# EAGLE design 5082_7415_mk1_v1 (EAGLE 6.5.0)
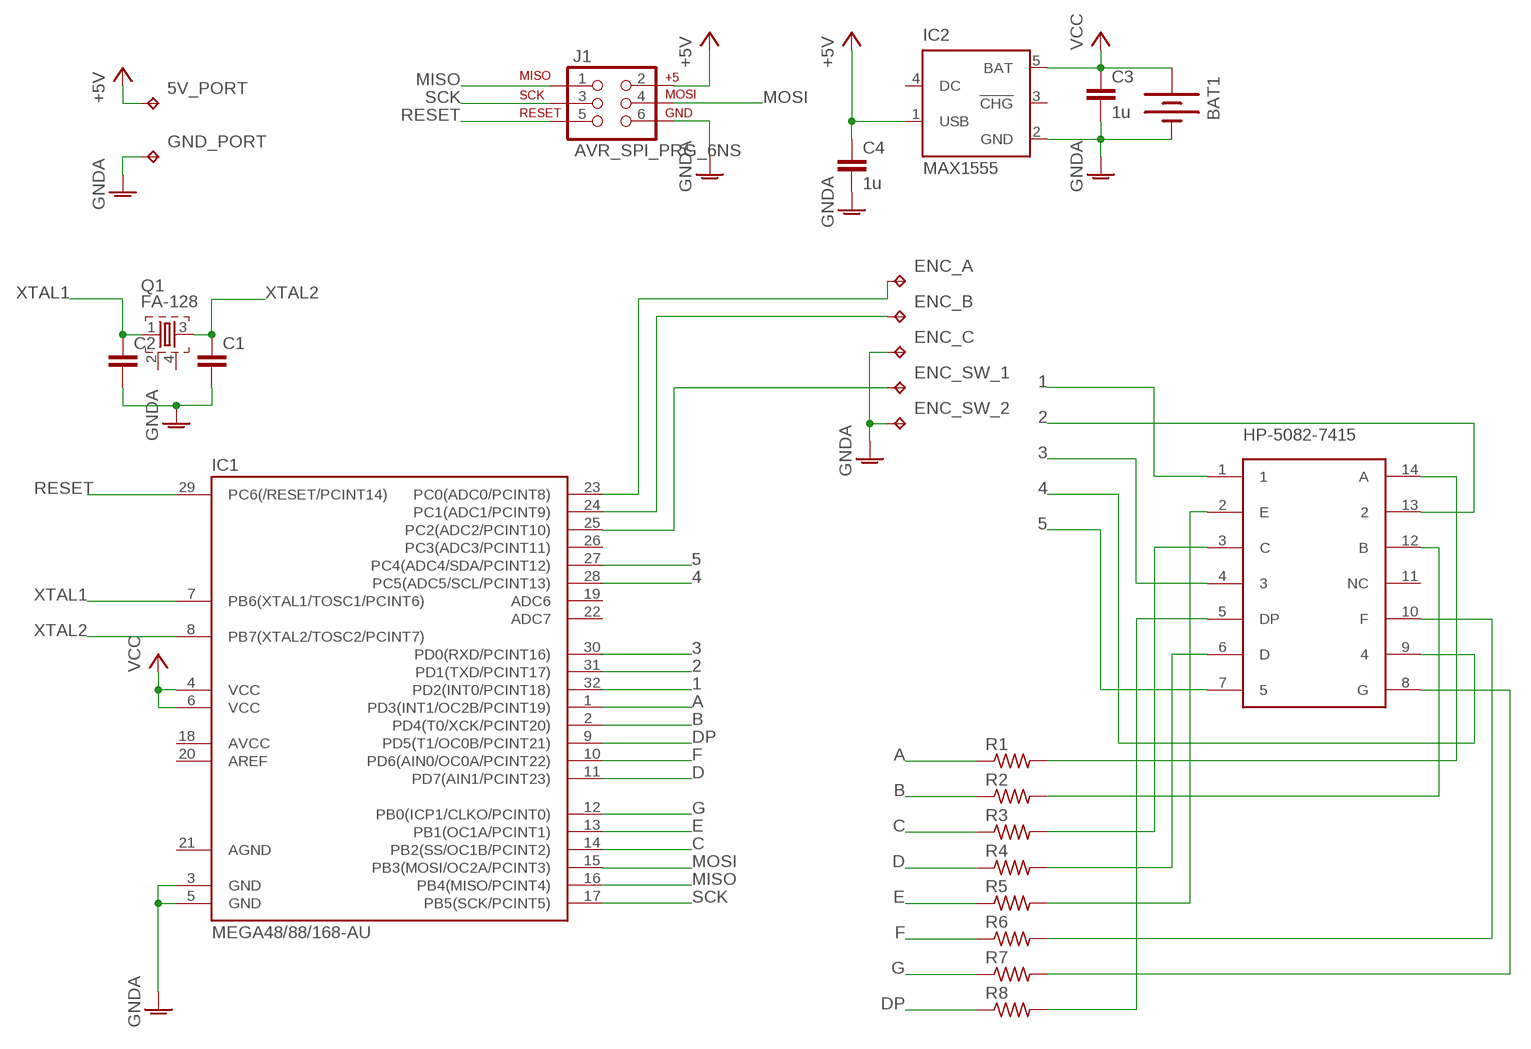
[diagram p0: schematic, sheet 1]

## Parts
5V_PORT  TPB2,54  [B2,54]
BAT1  BATTERY245MM  [BATTCON_245MM]
C1  C-EUC0805  [C0805]
C2  C-EUC0805  [C0805]
C3  1u  C-EUC0805  [C0805]
C4  1u  C-EUC0805  [C0805]
ENC_A  TPTP20SQ  [TP20SQ]
ENC_B  TPTP20SQ  [TP20SQ]
ENC_C  TPTP20SQ  [TP20SQ]
ENC_SW_1  TPTP20SQ  [TP20SQ]
ENC_SW_2  TPTP20SQ  [TP20SQ]
GND_PORT  TPB2,54  [B2,54]
IC1  MEGA48/88/168-AU  [TQFP32-08]
IC2  MAX1555  [SOT23-5L]
J1  AVR_SPI_PRG_6NS  [2X3-NS]
Q1  FA-128  [FA-128]
R1  R-US_M0805  [M0805]
R2  R-US_M0805  [M0805]
R3  R-US_M0805  [M0805]
R4  R-US_M0805  [M0805]
R5  R-US_M0805  [M0805]
R6  R-US_M0805  [M0805]
R7  R-US_M0805  [M0805]
R8  R-US_M0805  [M0805]
U$1  HP-5082-7415  [DIL14]

## Nets
1: IC1.32(PD2(INT0/PCINT18)) U$1.1
2: IC1.31(PD1(TXD/PCINT17)) U$1.13
3: IC1.30(PD0(RXD/PCINT16)) U$1.4
4: IC1.28(PC5(ADC5/SCL/PCINT13)) U$1.9
5: IC1.27(PC4(ADC4/SDA/PCINT12)) U$1.7
+5V: 5V_PORT.TP C4.1 IC2.1(USB) J1.2
A: IC1.1(PD3(INT1/OC2B/PCINT19)) R1.1
B: IC1.2(PD4(T0/XCK/PCINT20)) R2.1
C: IC1.14(PB2(SS/OC1B/PCINT2)) R3.1
D: IC1.11(PD7(AIN1/PCINT23)) R4.1
DP: IC1.9(PD5(T1/OC0B/PCINT21)) R8.1
E: IC1.13(PB1(OC1A/PCINT1)) R5.1
F: IC1.10(PD6(AIN0/OC0A/PCINT22)) R6.1
G: IC1.12(PB0(ICP1/CLKO/PCINT0)) R7.1
GNDA: BAT1.2(-) C1.2 C2.2 C3.2 C4.2 ENC_C.TP ENC_SW_2.TP GND_PORT.TP IC1.3(GND) IC1.5(GND) IC2.2(GND) J1.6
MISO: IC1.16(PB4(MISO/PCINT4)) J1.1
MOSI: IC1.15(PB3(MOSI/OC2A/PCINT3)) J1.4
N$1: R1.2 U$1.14(A)
N$2: R2.2 U$1.12(B)
N$3: R3.2 U$1.3(C)
N$4: R4.2 U$1.6(D)
N$5: R5.2 U$1.2(E)
N$6: R6.2 U$1.10(F)
N$7: R7.2 U$1.8(G)
N$8: R8.2 U$1.5(DP)
N$9: ENC_A.TP IC1.23(PC0(ADC0/PCINT8))
N$10: ENC_B.TP IC1.24(PC1(ADC1/PCINT9))
N$11: ENC_SW_1.TP IC1.25(PC2(ADC2/PCINT10))
RESET: IC1.29(PC6(/RESET/PCINT14)) J1.5
SCK: IC1.17(PB5(SCK/PCINT5)) J1.3
VCC: BAT1.1(+) C3.1 IC1.4(VCC) IC1.6(VCC) IC2.5(BAT)
XTAL1: C2.1 IC1.7(PB6(XTAL1/TOSC1/PCINT6)) Q1.1
XTAL2: C1.1 IC1.8(PB7(XTAL2/TOSC2/PCINT7)) Q1.3
Unconnected: IC1.18(AVCC) IC1.19(ADC6) IC1.20(AREF) IC1.22(ADC7) IC1.26(PC3(ADC3/PCINT11)) IC2.3(!CHG) IC2.4(DC) Q1.2 Q1.4 U$1.11(NC)

## Power pins joined to a net without a drawn wire
AGND: IC1.21(AGND)

## Library data of the parts
5V_PORT ENC_A ENC_B ENC_C ENC_SW_1 ENC_SW_2 GND_PORT = testpad:TP: Test pad
BAT1 = SparkFun-Electromechanical:BATTERY: Battery Holders Various common sizes : AA, AAA, 20mm coin cell and 12mm coin cell. 20MM_4LEGS, BATT-10373
C1-C4 = rcl:C-EU: CAPACITOR, European symbol
IC1 = avr-7:MEGA48/88/168
IC2 = maxim:MAX1555: Dual-Input USB/AC Adapter 1-Cell Li+ Battery Chargers Source: http://www.maxim-ic.com .. MAX1551-MAX1555.pdf; MF: MAXIM; MPN: MAX1555EZK+T; OC_FARNELL: 1628222; OC_NEWARK: 59J2761
J1 = SparkFun-Connectors:AVR_SPI_PRG_6: AVR ISP 6 Pin This is the reduced ISP connector for AVR programming. Common on Arduino. This footprint will take up less PCB space and can be used with a 10-pin to 6-pin adapter such as SKU: BOB-08508
Q1 = crystal:FA-: MHz RANGE CRYSTAL UNIT Source: Epson Toyocom
R1-R8 = rcl:R-US_: RESISTOR, American symbol
U$1 = custom_parts:HP-5082-7415

## Board
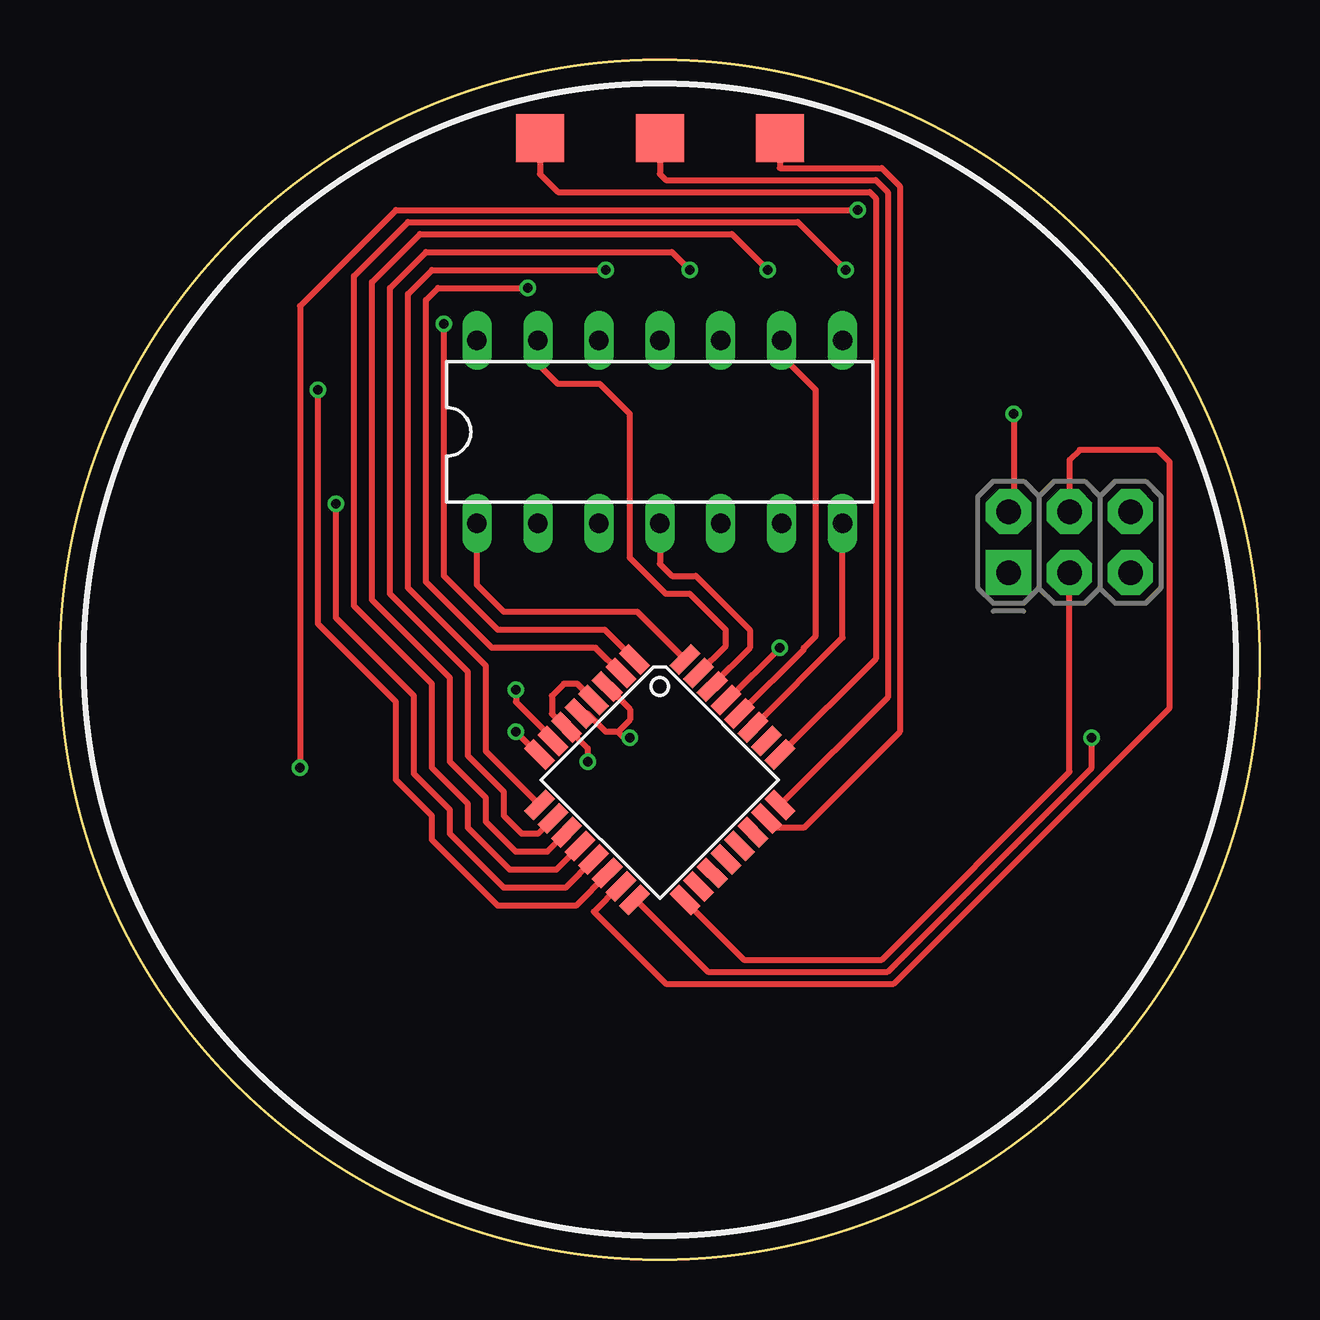
[diagram p1: board, top side]
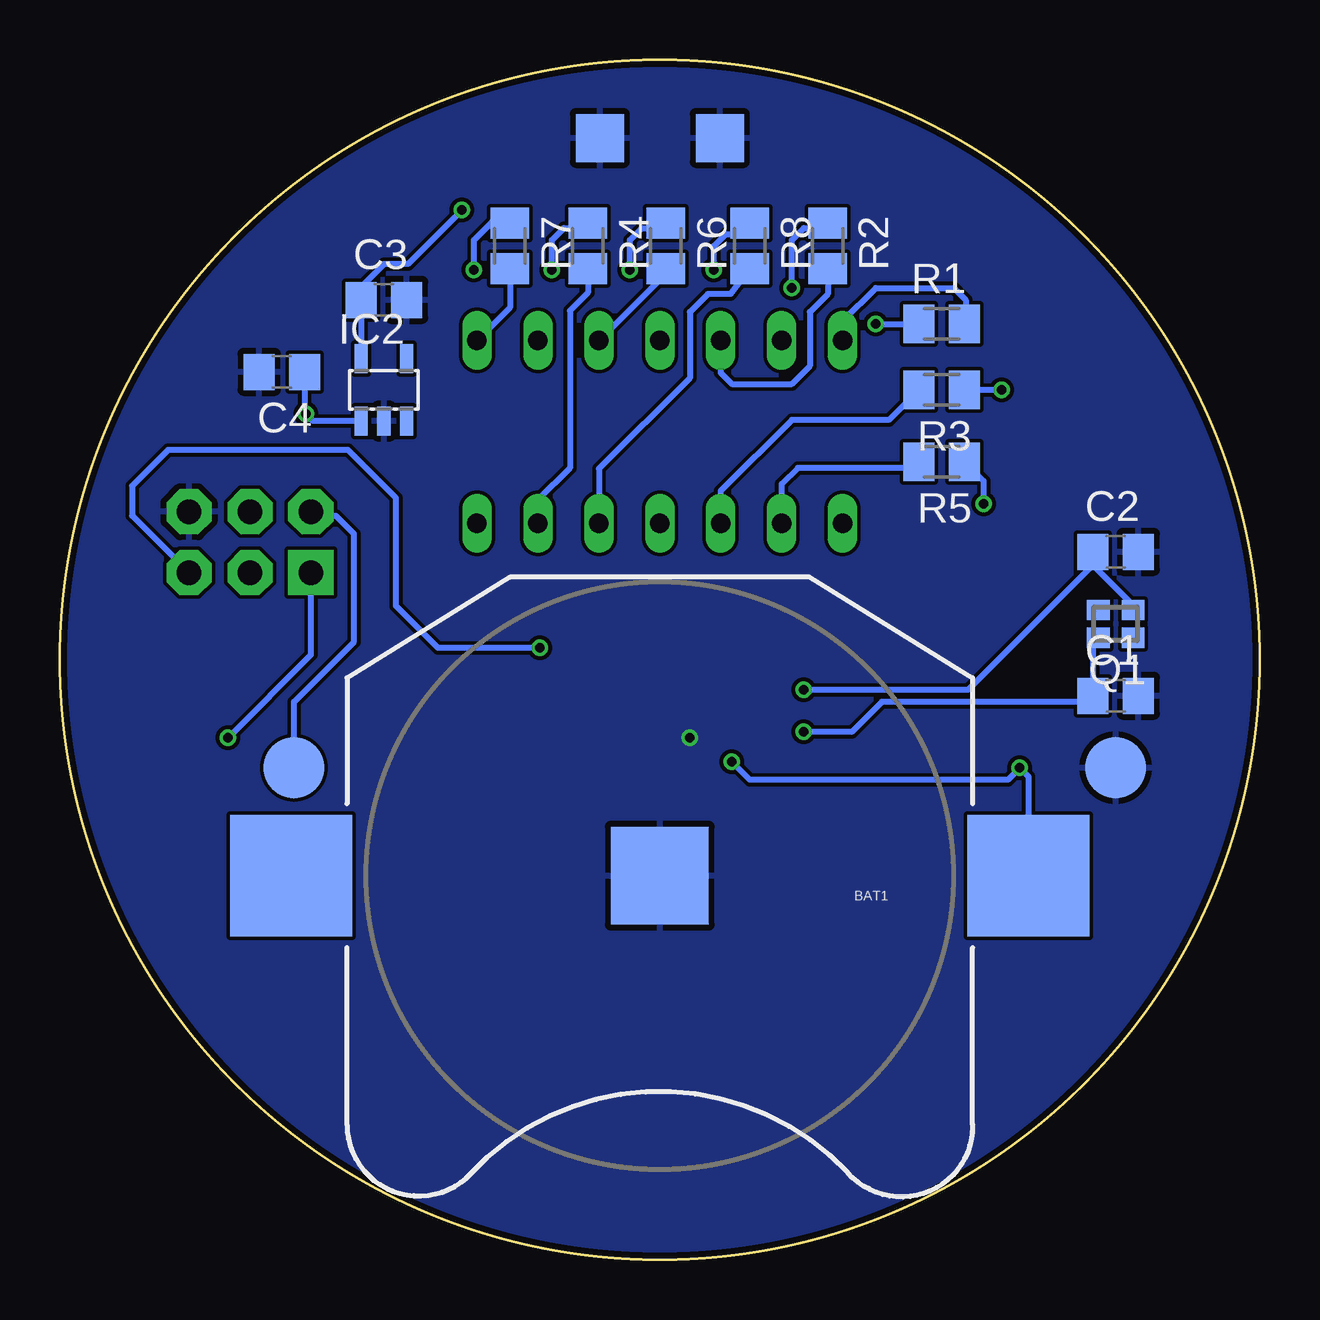
[diagram p2: board, bottom side, seen from below]

Size 50 x 50 mm. Coordinates in mm from the lower left corner, seen from the top.
Outline: circle at 25,25 radius 25
Copper layers (1*16): Top 0.035mm / dielectric 0.2mm / Bottom 0.035mm
Design rules "SeeedStudio_DRU_no_angle_20130527 *": minimum track width 6mil, minimum drill 12mil, track to track 6mil, track to pad 6mil, pad to pad 6mil, via to via 6mil, smd to smd 0mil, copper to edge 10mil, drill to drill 10mil, minimum pad ring 6mil, minimum via ring 6mil, stop-mask expansion 2mil, vias tented up to drill 25mil, thermal gap 10mil

### Footprints (pad centres in the part's own frame; a part is rotated, then mirrored left to right if it is on the bottom)
B2,54 = smd 2.54 x 2.54: TP 0,0
BATTCON_245MM = smd 5.08 x 5.08: 1 -15.367,0; 3 15.367,0 | smd 4.064 x 4.064: 2 0,0
C0805 = smd 1.3 x 1.5: 1 -0.95,0; 2 0.95,0
TP20SQ = smd 2 x 2: TP 0,0
TQFP32-08 = smd 1.27 x 0.559: 1 -4.293,2.8; 2 -4.293,2; 3 -4.293,1.2; 4 -4.293,0.4; 5 -4.293,-0.4; 6 -4.293,-1.2; 7 -4.293,-2; 8 -4.293,-2.8; 17 4.293,-2.8; 18 4.293,-2; 19 4.293,-1.2; 20 4.293,-0.4; 21 4.293,0.4; 22 4.293,1.2; 23 4.293,2; 24 4.293,2.8 | smd 0.559 x 1.27: 9 -2.8,-4.293; 10 -2,-4.293; 11 -1.2,-4.293; 12 -0.4,-4.293; 13 0.4,-4.293; 14 1.2,-4.293; 15 2,-4.293; 16 2.8,-4.293; 25 2.8,4.293; 26 2,4.293; 27 1.2,4.293; 28 0.4,4.293; 29 -0.4,4.293; 30 -1.2,4.293; 31 -2,4.293; 32 -2.8,4.293
SOT23-5L = smd 0.55 x 1.2: 1 -0.95,-1.3; 2 0,-1.3; 3 0.95,-1.3; 4 0.95,1.3; 5 -0.95,1.3
2X3-NS = drill 1.016 pad 1.88 square: 1 -2.54,-1.27 | drill 1.016 pad 1.88 octagon: 2 -2.54,1.27; 3 0,-1.27; 4 0,1.27; 5 2.54,-1.27; 6 2.54,1.27
FA-128 = smd 0.95 x 0.85: 1 -0.725,-0.575; 2 0.725,-0.575; 3 0.725,0.575; 4 -0.725,0.575
M0805 = smd 1.3 x 1.6: 1 -0.95,0; 2 0.95,0
DIL14 = drill 0.813 long: 1 -7.62,-3.81; 2 -5.08,-3.81; 3 -2.54,-3.81; 4 0,-3.81; 5 2.54,-3.81; 6 5.08,-3.81; 7 7.62,-3.81; 8 7.62,3.81; 9 5.08,3.81; 10 2.54,3.81; 11 0,3.81; 12 -2.54,3.81; 13 -5.08,3.81; 14 -7.62,3.81

### Placement (x,y rotation side)
5V_PORT  40.25,20.5 0 bottom
BAT1  25,16 180 bottom
C1  6,23.5 0 bottom
C2  6,29.5 0 bottom
C3  36.5,40 0 bottom
C4  40.75,37 180 bottom
ENC_A  30,46.75 0 top
ENC_B  25,46.75 0 top
ENC_C  22.5,46.75 0 bottom
ENC_SW_1  20,46.75 0 top
ENC_SW_2  27.5,46.75 0 bottom
GND_PORT  6,20.5 0 bottom
IC1  25,20 315 top
IC2  36.5,36.25 0 bottom
J1  42.08,29.9 0 top
Q1  6,26.5 180 bottom
R1  13.25,39 0 bottom
R2  18,42.25 270 bottom
R3  13.25,36.25 180 bottom
R4  28,42.25 270 bottom
R5  13.25,33.25 180 bottom
R6  24.75,42.25 270 bottom
R7  31.25,42.25 270 bottom
R8  21.25,42.25 270 bottom
U$1  25,34.5 0 top

### Tracks (layer width: path | path; a pad name or v marks a point on that pad's centre or on a via)
1
  Top 0.254: IC1.32 24.07,27 18.5,27 17.38,28.12 U$1.1
2
  Top 0.254: IC1.31 27.75,25.58 27.75,26.25 26.25,27.75 25.25,27.75 23.75,29.25 23.75,35.25 22.5,36.5 20.75,36.5 19.92,37.33 U$1.13
3
  Top 0.254: U$1.4 25,29 25.5,28.5 26.5,28.5 28.75,26.25 28.75,25.5 27.19,23.94 IC1.30
4
  Top 0.254: IC1.28 31,25.43 31,25.5 31.5,26 31.5,36.25 30.08,37.67 U$1.9
5
  Top 0.254: IC1.27 32.62,25.92 U$1.7
+5V  (via drill 0.4)
  Top 0.254: v39.75,35.25 39.75,31.38 J1.2
  Bottom 0.254: 5V_PORT.TP 40.25,23.25 37.75,25.75 37.75,30.25 38.5,31 39.37,31 J1.2 | 39.75,36.95 C4.1 39.8,35.3 v39.75,35.25 39.45,34.95 IC2.1
A  (via drill 0.4)
  Top 0.254: IC1.1 22.71,26.25 18.25,26.25 16,28.5 v16,39
  Bottom 0.254: v16,39 R1.1
B  (via drill 0.4)
  Top 0.254: IC1.2 22.33,25.5 18,25.5 15.25,28.25 15.25,40 15.75,40.5 v19.5,40.5
  Bottom 0.254: v19.5,40.5 19.5,42.5 19,43 18.2,43 R2.1
C  (via drill 0.4)
  Top 0.254: IC1.14 22.81,16.06 21.5,14.75 18.25,14.75 15.5,17.5 15.5,18.5 14,20 14,23.25 10.75,26.5 v10.75,36.25
  Bottom 0.254: v10.75,36.25 R3.1
D  (via drill 0.4)
  Top 0.254: IC1.11 20.3,17 19,17 17.75,18.25 17.75,19.25 16.25,20.75 16.25,24.25 13,27.5 13,40.75 15,42.75 28,42.75 v29.5,41.25
  Bottom 0.254: v29.5,41.25 29.5,42.5 29,43 28.2,43 R4.1
DP  (via drill 0.4)
  Top 0.254: IC1.9 17.75,21.18 17.75,24.75 14.5,28 14.5,40.25 15.5,41.25 v22.75,41.25
  Bottom 0.254: v22.75,41.25 22.75,42.25 22.25,42.75 21.45,42.75 R8.1
E  (via drill 0.4)
  Top 0.254: IC1.13 21.07,15.5 18.5,15.5 16.25,17.75 16.25,18.75 14.75,20.25 14.75,23.5 11.5,26.75 v11.5,31.5
  Bottom 0.254: v11.5,31.5 11.5,32.45 R5.1
F  (via drill 0.4)
  Top 0.254: IC1.10 19.92,17.75 19.25,17.75 18.5,18.5 18.5,19.5 17,21 17,24.5 13.75,27.75 13.75,40.5 15.25,42 25.5,42 v26.25,41.25
  Bottom 0.254: 24.8,43.25 R6.1 24.95,43 25.75,43 26.25,42.5 v26.25,41.25
G  (via drill 0.4)
  Top 0.254: IC1.12 20.68,16.25 18.75,16.25 17,18 17,19 15.5,20.5 15.5,24 12.25,27.25 12.25,41 14.5,43.25 30.75,43.25 v32.75,41.25
  Bottom 0.254: 31.45,43 R7.1 31.3,43.25 32,43.25 32.75,42.5 v32.75,41.25
GNDA  (via drill 0.4)
  Top 0.254: IC1.3 23.75,22.95 23.75,22.5 23.25,22 | 23.25,22 22.75,22 22,22.75 IC1.5 | 23.25,22 23.5,21.75 v23.75,21.75
  pour Bottom: 0,50 50,50 50,0 0,0
MISO  (via drill 0.4)
  Top 0.254: IC1.16 24.02,14.98 27,12 34.5,12 43,20.5 v43,21.75
  Bottom 0.254: v43,21.75 39.54,25.21 J1.1
MOSI
  Top 0.254: IC1.15 23.3,15.55 22.25,14.5 25.25,11.5 34.75,11.5 46.25,23 46.25,33.25 45.75,33.75 42.5,33.75 42.08,33.33 J1.4
N$1
  Bottom 0.254: U$1.14 17.38,39.12 16,40.5 12.75,40.5 12.25,40 12.25,39.05 R1.2
N$2
  Bottom 0.254: R2.2 18,40.25 18.75,39.5 18.75,37.25 19.5,36.5 22,36.5 22.46,36.96 U$1.12
N$3
  Bottom 0.254: R3.2 15.45,35 19.5,35 22.46,32.04 U$1.3
N$4
  Bottom 0.254: U$1.6 30.08,31.67 28.75,33 28.75,39.55 28,40.3 R4.2
N$5
  Bottom 0.254: R5.2 14.45,33 19.25,33 19.92,32.33 U$1.2
N$6
  Bottom 0.254: R6.2 24.75,41.1 U$1.10
N$7
  Bottom 0.254: R7.2 31.25,39.68 U$1.8
N$8
  Bottom 0.254: U$1.5 27.54,32.96 23.75,36.75 23.75,39.5 23,40.25 22.05,40.25 R8.2
N$9
  Top 0.254: ENC_A.TP 30,45.5 34.25,45.5 35,44.75 35,22 31,18 29.83,18 IC1.23
N$10
  Top 0.254: ENC_B.TP 25,45.25 25.25,45 34,45 34.5,44.5 34.5,23.43 IC1.24
N$11
  Top 0.254: ENC_SW_1.TP 20,45.25 20.75,44.5 33.75,44.5 34,44.25 34,25.04 IC1.25
RESET  (via drill 0.4)
  Top 0.254: IC1.29 27.82,23.32 v30,25.5
  Bottom 0.254: v30,25.5 34.25,25.5 36,27.25 36,31.75 38,33.75 45.5,33.75 47,32.25 47,31.01 J1.5
SCK
  Top 0.254: IC1.17 26.05,14.95 28.5,12.5 34.25,12.5 42.08,20.33 J1.3
VCC  (via drill 0.4)
  Top 0.254: IC1.4 21.57,24 21,24 20.5,23.5 20.5,22.75 21.06,22.19 IC1.6 22,21.3 v22,20.75 | v10,20.5 10,39.75 14,43.75 v33.25,43.75
  Bottom 0.254: BAT1.1 9.63,20.13 v10,20.5 10.5,20 21.25,20 v22,20.75 | IC2.5 C3.1 37.5,40.05 37.5,40.5 36.5,41.5 35.5,41.5 v33.25,43.75
XTAL1  (via drill 0.4)
  Top 0.254: v19,23.75 19,23.25 20.55,21.7 IC1.7
  Bottom 0.254: C2.1 6.95,28.95 | 6.95,28.95 5.28,27.27 Q1.1 | 6.95,28.95 12.15,23.75 v19,23.75
XTAL2  (via drill 0.4)
  Top 0.254: v19,22 19.95,21.05 IC1.8
  Bottom 0.254: Q1.3 6.95,25.7 C1.1 7.2,23.25 15.75,23.25 17,22 v19,22